# Altium schematic sheet 2020-08-19_08-57-041.schdoc
size 208 x 109 mm; SheetNumber: 1; SheetTotal: 1
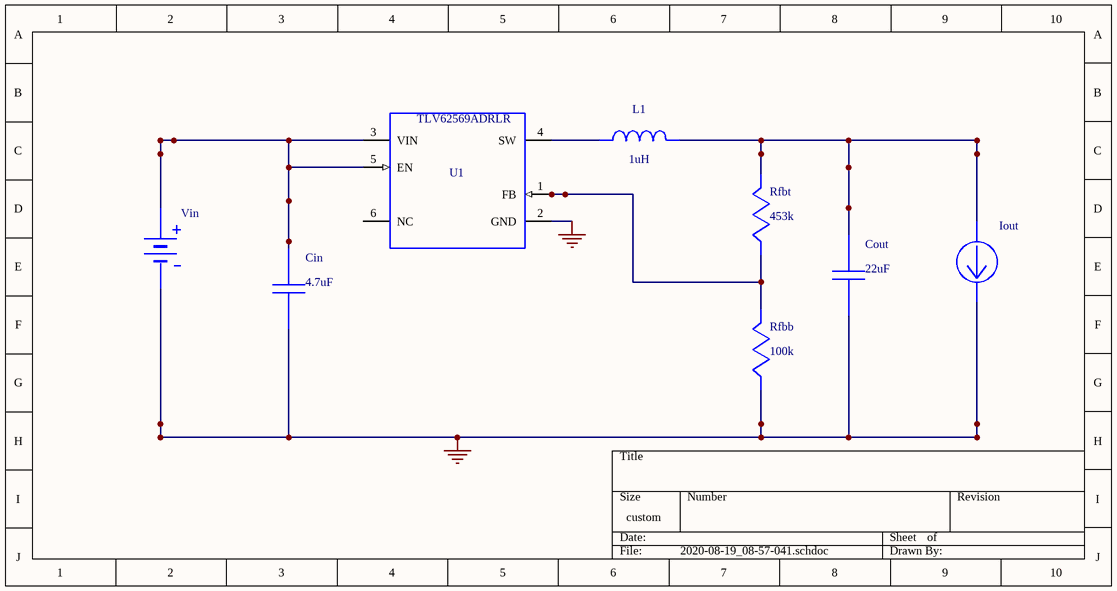
[diagram p0: 2020-08-19_08-57-041.schdoc]

## Parts
Cin  value 4.7uF  (hidden comment: C1608X7S1A475K080AC)
Cout  value 22uF  (hidden comment: GRM188R60J226MEA0D)
Iout  WB_CURRENT_LOAD  (value not drawn)
L1  value 1uH  (hidden comment: SRN8040-1R0Y)
Rfbb  value 100k  (hidden comment: CRCW0402100KFKED)
Rfbt  value 453k  (hidden comment: CRCW0402453KFKED)
U1  TLV62569ADRLR
Vin  WB_BATTERY  (value not drawn)

## Nets
0: Cin.2 Cout.2 Iout.2(-) Rfbb.2 U1.2(GND) Vin.2(-)
NetCin_1: Cin.1 U1.3(VIN) U1.5(EN) Vin.1(+)
NetCout_1: Cout.1 Iout.1(+) L1.2 Rfbt.1
NetL1_1: L1.1 U1.4(SW)
NetRfbb_1: Rfbb.1 Rfbt.2 U1.1(FB)

Not connected (* = marked no-connect by the designer): U1 6(NC)

## Library data of the parts
Cin = C1608X7S1A475K080AC: C1608X7S1A475K08; Manufacturer Name: TDK; PackageReference: C1608X7S1A475K080AC; Manufacturer Part Number: C1608X7S1A475K080AC
Cout = GRM188R60J226MEA0D: GRM188R60J226MEA; Manufacturer Name: MuRata; PackageReference: GRM188R60J226MEA0D; Manufacturer Part Number: GRM188R60J226MEA0D
L1 = SRN8040-1R0Y: Manufacturer Name: Bourns; PackageReference: SRN8040-1R0Y; Manufacturer Part Number: SRN8040-1R0Y
Rfbb = CRCW0402100KFKED: Manufacturer Name: Vishay-Dale; PackageReference: CRCW0402100KFKED; Manufacturer Part Number: CRCW0402100KFKED
Rfbt = CRCW0402453KFKED: Manufacturer Name: Vishay-Dale; PackageReference: CRCW0402453KFKED; Manufacturer Part Number: CRCW0402453KFKED
U1 = TLV62569ADRLR: Manufacturer Name: Texas Instruments; PackageReference: TLV62569ADRLR; Manufacturer Part Number: TLV62569ADRLR; Value: N/A
Iout = WB_CURRENT_LOAD: PackageReference: WB_CURRENT_LOAD; Manufacturer Part Number: WB_CURRENT_LOAD; Manufacturer Name: WB_CURRENT_LOAD; Value: N/A
Vin = WB_BATTERY: PackageReference: WB_BATTERY; Manufacturer Part Number: WB_BATTERY; Manufacturer Name: WB_BATTERY; Value: N/A